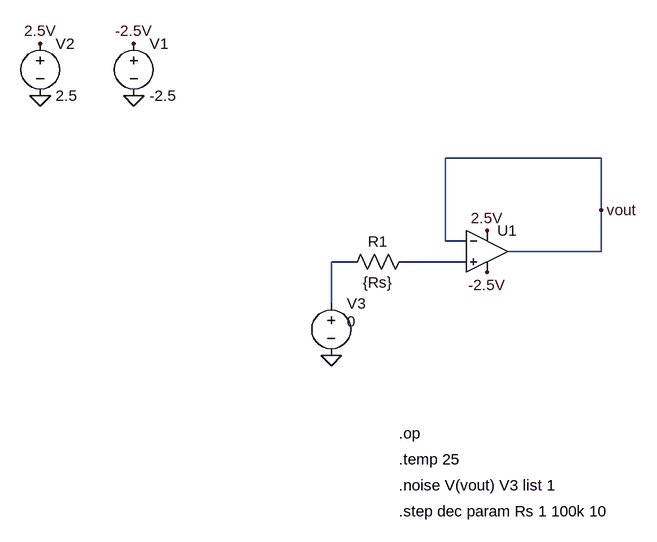
[diagram p0: schematic opamp_noise_testbench.asc]
opamp_noise_testbench.asc, the LTspice schematic file:
Version 4
SHEET 1 880 680
WIRE 368 48 128 48
WIRE 368 128 368 48
WIRE 128 176 128 48
WIRE 160 176 128 176
WIRE 368 192 368 128
WIRE 368 192 224 192
WIRE -16 208 -48 208
WIRE 160 208 64 208
WIRE -48 272 -48 208
FLAG -352 -48 0
FLAG -496 -48 0
FLAG -496 -128 2.5V
FLAG -352 -128 -2.5V
FLAG 192 160 2.5V
FLAG 192 224 -2.5V
FLAG -48 352 0
FLAG 368 128 vout
DATAFLAG 256 48 ""
SYMBOL voltage -352 -144 R0
WINDOW 123 0 0 Left 0
WINDOW 39 0 0 Left 0
SYMATTR InstName V1
SYMATTR Value -2.5
SYMBOL voltage -496 -144 R0
WINDOW 123 0 0 Left 0
WINDOW 39 0 0 Left 0
SYMATTR InstName V2
SYMATTR Value 2.5
SYMBOL voltage -48 256 R0
WINDOW 3 24 44 Left 2
WINDOW 123 0 0 Left 0
WINDOW 39 0 0 Left 0
SYMATTR Value 0
SYMATTR InstName V3
SYMBOL res 80 192 R90
WINDOW 0 0 56 VBottom 2
WINDOW 3 32 56 VTop 2
SYMATTR InstName R1
SYMATTR Value {Rs}
SYMBOL Opamps\\UniversalOpamp2 192 192 R0
SYMATTR InstName U1
SYMATTR SpiceLine2 en=10n enk=0 in=1p ink=0 Rin=500Meg
TEXT 56 472 Left 2 !.op
TEXT 56 512 Left 2 !.temp 25
TEXT 56 552 Left 2 !.noise V(vout) V3 list 1
TEXT 56 592 Left 2 !.step dec param Rs 1 100k 10

The netlist it stands for:
* opamp_noise_testbench.asc
V1 -2.5V 0 -2.5
V2 2.5V 0 2.5
V3 N001 0 0
R1 N002 N001 {Rs}
XU1 N002 vout 2.5V -2.5V vout level.2 Avol=1Meg GBW=10Meg Slew=10Meg ilimit=25m rail=0 Vos=0 phimargin=45 en=10n enk=0 in=1p ink=0 Rin=500Meg  ; pins IN+ IN- V+ V- OUT
.op
.temp 25
.noise V(vout) V3 list 1
.step dec param Rs 1 100k 10
.lib UniversalOpamps2.sub
.backanno
.end